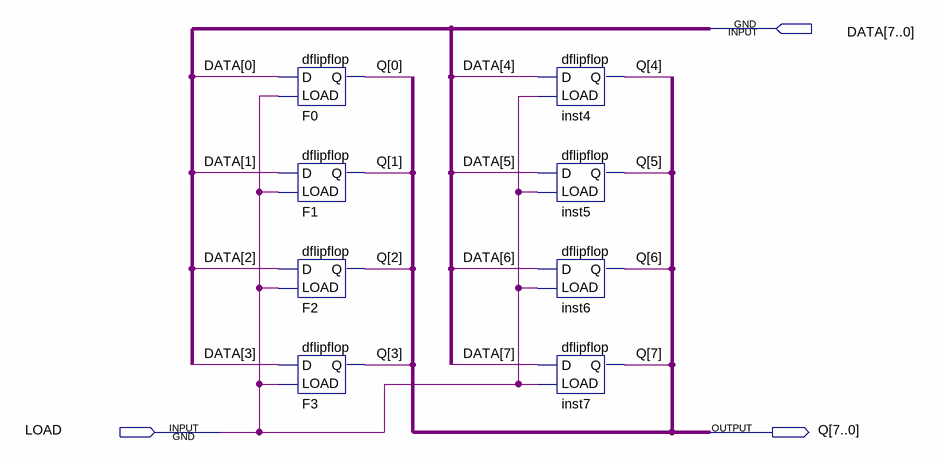
[diagram p0: schematic sheet]
// Quartus schematic register8bit.bdf as structural Verilog: 8 symbols, 3 pins
module register8bit (
  input  [7:0] DATA,
  input  LOAD,
  output [7:0] Q
);

  dflipflop F0 (.D(DATA[0]), .LOAD(LOAD), .Q(Q[0]));
  dflipflop F1 (.D(DATA[1]), .LOAD(LOAD), .Q(Q[1]));
  dflipflop F2 (.D(DATA[2]), .LOAD(LOAD), .Q(Q[2]));
  dflipflop F3 (.D(DATA[3]), .LOAD(LOAD), .Q(Q[3]));
  dflipflop inst4 (.D(DATA[4]), .LOAD(LOAD), .Q(Q[4]));
  dflipflop inst5 (.D(DATA[5]), .LOAD(LOAD), .Q(Q[5]));
  dflipflop inst6 (.D(DATA[6]), .LOAD(LOAD), .Q(Q[6]));
  dflipflop inst7 (.D(DATA[7]), .LOAD(LOAD), .Q(Q[7]));
endmodule
